# EAGLE schematic PumpSolBoardV2 (EAGLE 6.5.0)
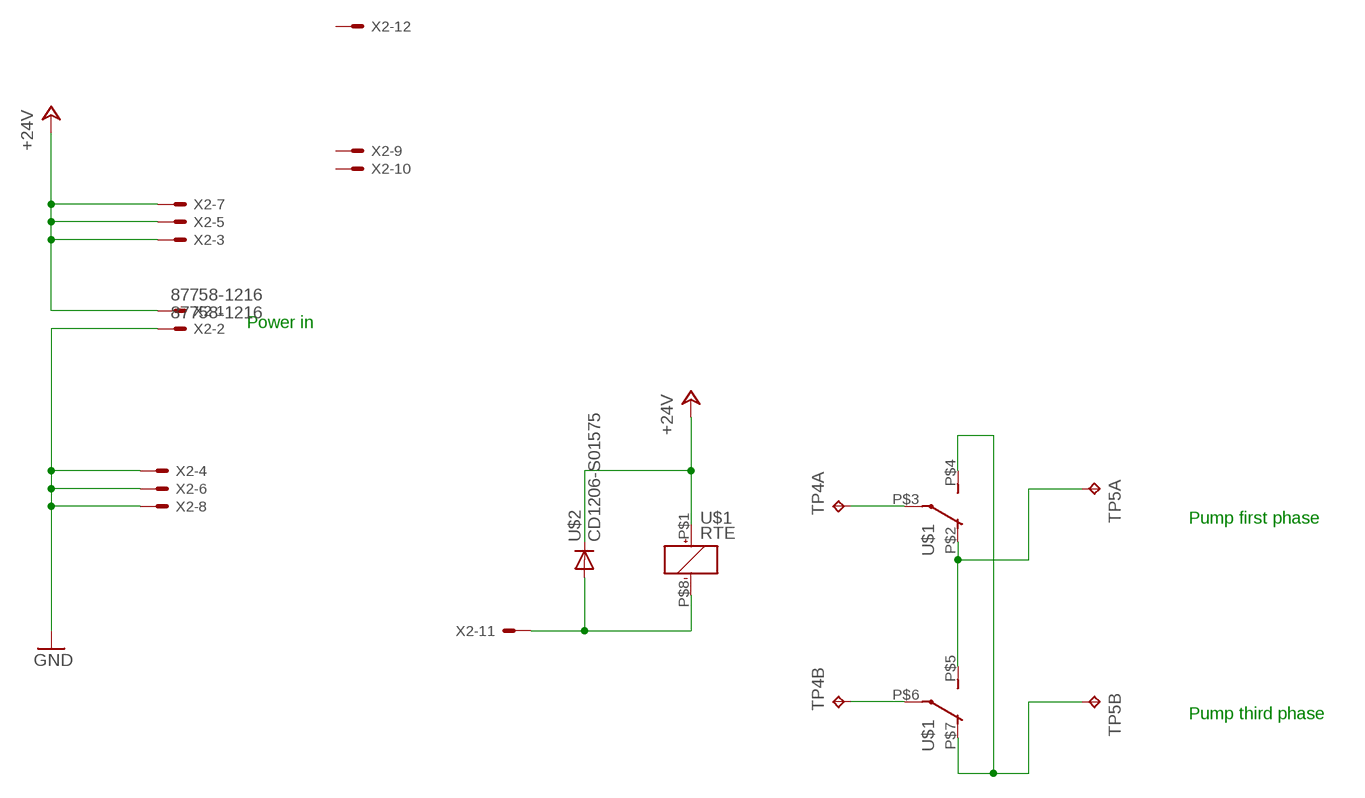
[diagram p0: schematic, sheet 1]

## Parts
TP4  TP2P2-38-20  [P2-38-20]
TP5  TP2P2-38-20  [P2-38-20]
U$1  RTE  [RTE]
U$2  CD1206-S01575  [CD1206]
X2  87758-1216  [87758-1216]

## Nets
+24V: U$1.P$1(+) U$2.K(C) X2.1 X2.3 X2.5 X2.7
GND: X2.2 X2.4 X2.6 X2.8
N$5: U$1.P$8(-) U$2.A X2.11
N$10: TP5.TP-1 U$1.P$2(O) U$1.P$5(S)
N$11: TP5.TP-2 U$1.P$4(S) U$1.P$7(O)
N$13: TP4.TP-1 U$1.P$3(P)
N$14: TP4.TP-2 U$1.P$6(P)
Unconnected: X2.9 X2.10 X2.12

## Notes on the sheet
- Power in
- Pump first phase
- Pump third phase

## Library data of the parts
TP4 TP5 = testpad:TP2: Test pad
U$1 = relay:RTE
U$2 = diode:CD1206-S01575
X2 = con-molex:87758-1216: 12 Pin - 2mm Dual Row Single Wafer, Vertical T/H HDR Source: http://www.molex.com/pdm_docs/sd/877580616_sd.pdf; MPN: 87758-1216; OC_FARNELL: unknown; OC_NEWARK: 25M5671